# Altium project Modular_Clock.PrjPcb
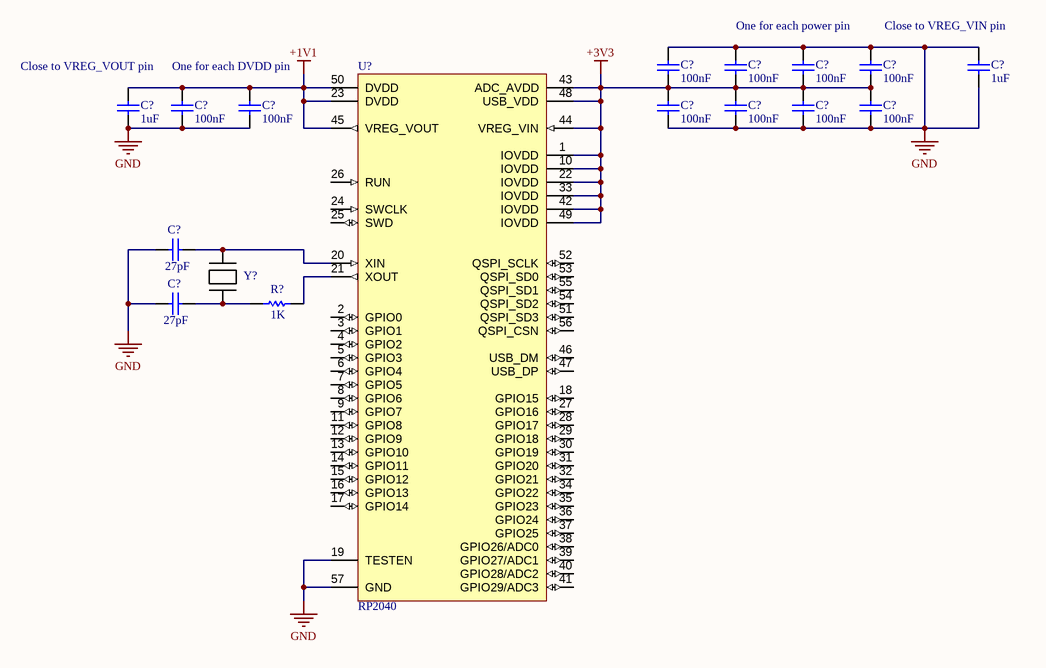
[diagram p0: RP2040.SchDoc]
1 sheet, 17 parts. Net scope: global (net labels, ports and power ports of the same name join across sheets).

## Sheet RP2040.SchDoc
size A4; SheetNumber: 1; SheetTotal: 1; SPICEModelCacheRTTJKVNO: <root> / <DocumentId>RTTJKVNO</DocumentId> / <CacheFrame Number="0"> / <Model Name="cap" Kind="MDL"> / <Text>*Default semiconductor capacitor / .MODEL CAP C()</Text> / </Model> / </CacheFrame> / </root>

### Parts
(Parts that share a designator on the sheet are numbered #1, #2 ... from top to bottom, then left to right.)
C?#1  value 100nF  [1608[0603]]  (hidden comment: Cap)
C?#2  value 100nF  [1608[0603]]  (hidden comment: Cap)
C?#3  value 100nF  [1608[0603]]  (hidden comment: Cap)
C?#4  value 100nF  [1608[0603]]  (hidden comment: Cap)
C?#5  value 1uF  [1608[0603]]  (hidden comment: Cap)
C?#6  value 1uF  [1608[0603]]  (hidden comment: Cap)
C?#7  value 100nF  [1608[0603]]  (hidden comment: Cap)
C?#8  value 100nF  [1608[0603]]  (hidden comment: Cap)
C?#9  value 100nF  [1608[0603]]  (hidden comment: Cap)
C?#10  value 100nF  [1608[0603]]  (hidden comment: Cap)
C?#11  value 100nF  [1608[0603]]  (hidden comment: Cap)
C?#12  value 100nF  [1608[0603]]  (hidden comment: Cap)
C?#13  value 27pF  [1608[0603]]  (hidden comment: Cap)
C?#14  value 27pF  [1608[0603]]  (hidden comment: Cap)
R?  value 1K  [J1-0603]  (hidden comment: Res1)
U?  RP2040  [QFN40P700X700X90-57N]
Y?  ABLS-12.000MHZ-B4-T  [XTAL1140X470X420N]  (value not drawn)

### Nets
+1V1: C?#6.2 C?#7.2 C?#8.2 U?.23(DVDD) U?.45(VREG_VOUT) U?.50(DVDD)
+3V3: C?#1.1 C?#2.1 C?#3.1 C?#4.1 C?#9.2 C?#10.2 C?#11.2 C?#12.2 U?.1(IOVDD) U?.10(IOVDD) U?.22(IOVDD) U?.33(IOVDD) U?.42(IOVDD) U?.43(ADC_AVDD) U?.44(VREG_VIN) U?.48(USB_VDD) U?.49(IOVDD)
GND: C?#1.2 C?#2.2 C?#3.2 C?#4.2 C?#5.1 C?#5.2 C?#6.1 C?#7.1 C?#8.1 C?#9.1 C?#10.1 C?#11.1 C?#12.1 C?#13.2 C?#14.2 U?.19(TESTEN) U?.57(GND)
NetC?#13_1: C?#13.1 U?.20(XIN) Y?.2
NetC?#14_1: C?#14.1 R?.1 Y?.1
NetR?_2: R?.2 U?.21(XOUT)

Not connected (* = marked no-connect by the designer): U? 2(GPIO0) 3(GPIO1) 4(GPIO2) 5(GPIO3) 6(GPIO4) 7(GPIO5) 8(GPIO6) 9(GPIO7) 11(GPIO8) 12(GPIO9) 13(GPIO10) 14(GPIO11) 15(GPIO12) 16(GPIO13) 17(GPIO14) 18(GPIO15) 24(SWCLK) 25(SWD) 26(RUN) 27(GPIO16) 28(GPIO17) 29(GPIO18) 30(GPIO19) 31(GPIO20) 32(GPIO21) 34(GPIO22) 35(GPIO23) 36(GPIO24) 37(GPIO25) 38(GPIO26/ADC0) 39(GPIO27/ADC1) 40(GPIO28/ADC2) 41(GPIO29/ADC3) 46(USB_DM) 47(USB_DP) 51(QSPI_SD3) 52(QSPI_SCLK) 53(QSPI_SD0) 54(QSPI_SD2) 55(QSPI_SD1) 56(QSPI_CSN)

### Notes on the sheet
- (near C?#2) One for each power pin
- (near C?#5) Close to VREG_VIN pin
- (near C?#6) Close to VREG_VOUT pin
- (near C?#7) One for each DVDD pin
- DWG. NO.
- REV.
- SHT.
- REVISION
- DESCRIPTION
- DATE
- APPROVED
- THIS DOCUMENT AND THE DATA DISCLOSED HEREIN OR HEREWITH IS THE PROPERTY OF ALTIUM LIMITED AND MAY BE FREELY DISTRIBUTED IN WHOLE. NO RIGHTS ARE RESERVED OR EXPRESS OR IMPLIED WARANTEE GIVEN.
- ENG:
- DSN:
- APPROVALS
- PROJECT
- DOCUMENT REVISION:
- DESIGN ITEM:
- CHK:
- BOM:
- REFERENCE DOCUMENTS
- PROJECT REVISION:
- TITLE
- FAB DWG:
- PCB DWG:
- ASSY DWG:
- SCALE:
- SIZE
- C
- CAGE CODE
- FILE NAME
- DWG NO.
- SHEET
- OF
- REV

### Library data of the parts
C?#1-C?#14 = Cap: Capacitor; Published: 8-Jun-2000; LatestRevisionDate: 17-Jul-2002; LatestRevisionNote: Re-released for DXP Platform.; PackageReference: RAD-0.3; Publisher: Altium Limited; PackageDescription: Radial Cap, Thru-Hole; 2 Leads; 0.3 in Pin Spacing
R? = Res1: Resistor; Published: 8-Jun-2000; LatestRevisionDate: 17-Jul-2002; LatestRevisionNote: Re-released for DXP Platform.; PackageReference: AXIAL-0.3; Publisher: Altium Limited; PackageDescription: Axial Device, Thru-Hole; 2 Leads; 0.3 in Pin Spacing
U? = RP2040: ARM® Cortex®-M0+ series Microcontroller IC 32-Bit Dual-Core 133MHz - External Program Memory 56-QFN (7x7); MF: Raspberry Pi; SnapEDA_Link: https://www.snapeda.com/parts/RP2040/Raspberry+Pi/view-part/?ref=snap; Value: *; Purchase-URL: https://pricing.snapeda.com/search/part/RP2040/?ref=eda; MP: RP2040; Availability: In Stock; Check_prices: https://www.snapeda.com/parts/RP2040/Raspberry+Pi/view-part/?ref=eda; Package: None; Price: None
Y? = ABLS-12.000MHZ-B4-T: CRYSTAL 12.0000MHZ 18PF SMD